# EAGLE design relay_din_board (EAGLE 6.4)
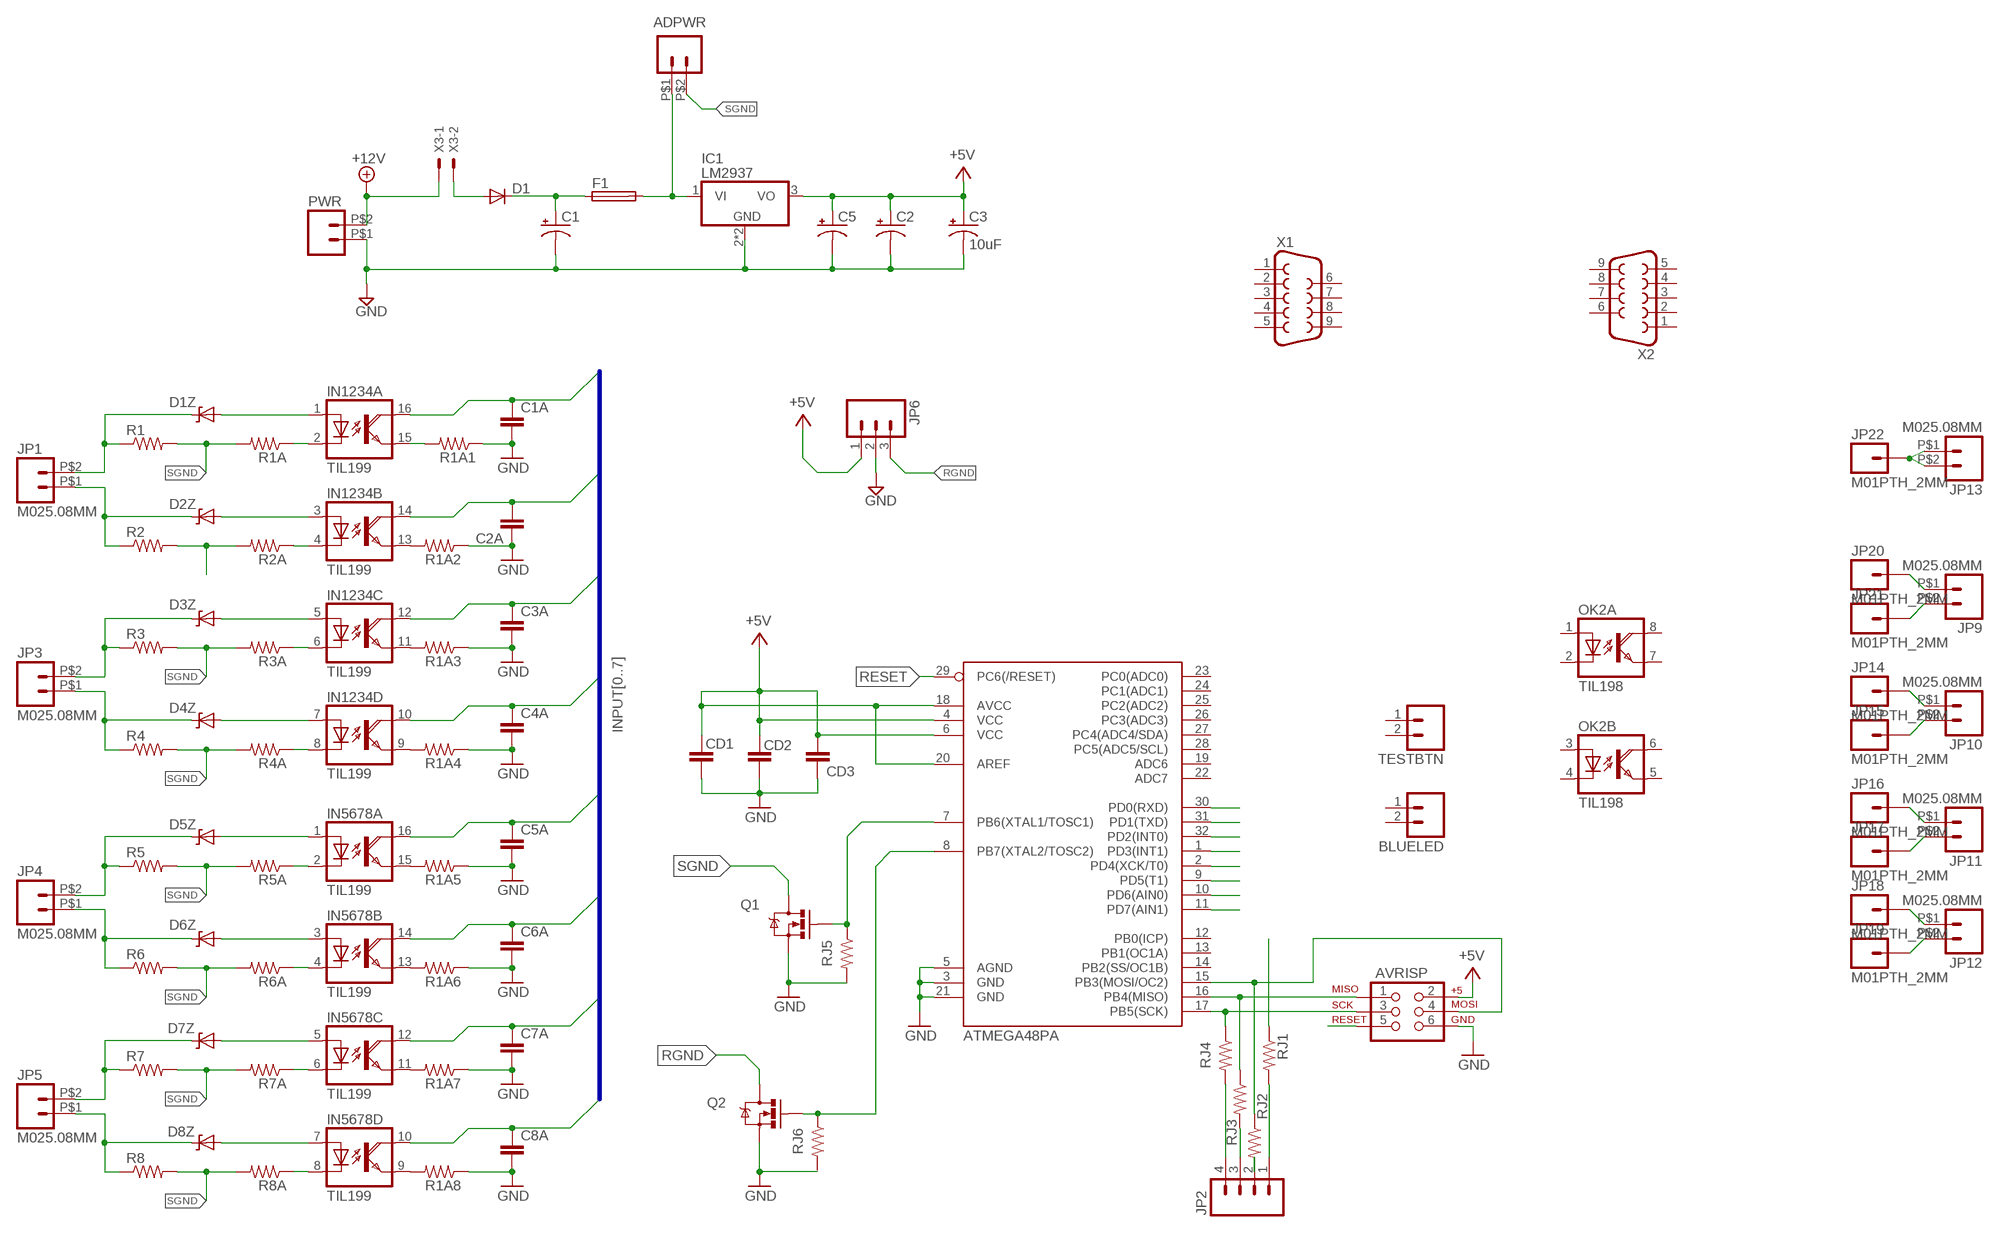
[diagram p0: schematic, sheet 1]

## Parts
ADPWR  M025.08MM  [SCREWTERMINAL-5.08MM-2]
ATMEGA48PA  ATMEGA168  [TQFP32-08]
AVRISP  AVR_SPI_PRG_6PTH  [2X3]
BLUELED  M02PTH  [1X02]
C1  CPOL-USE5-10.5  [E5-10,5]
C1A  CAP0805  [0805]
C2  CPOL-US153CLV-0605  [153CLV-0605]
C2A  CAP0805  [0805]
C3  10uF  10UF-TANT  [EIA3216]
C3A  CAP0805  [0805]
C4A  CAP0805  [0805]
C5  CPOL-US153CLV-0605  [153CLV-0605]
C5A  CAP0805  [0805]
C6A  CAP0805  [0805]
C7A  CAP0805  [0805]
C8A  CAP0805  [0805]
CD1  CAP0805  [0805]
CD2  CAP0805  [0805]
CD3  CAP0805  [0805]
D1  DIODE-C1702-05  [C1702-05]
D1Z  DIODE-ZENER-BZT52  [SOD-323]
D2Z  DIODE-ZENER-BZT52  [SOD-323]
D3Z  DIODE-ZENER-BZT52  [SOD-323]
D4Z  DIODE-ZENER-BZT52  [SOD-323]
D5Z  DIODE-ZENER-BZT52  [SOD-323]
D6Z  DIODE-ZENER-BZT52  [SOD-323]
D7Z  DIODE-ZENER-BZT52  [SOD-323]
D8Z  DIODE-ZENER-BZT52  [SOD-323]
F1  GSH15  [GSH15]
IC1  LM2937  [TO263-3]
IN1234  TIL199  [DIL16]
IN5678  TIL199  [DIL16]
JP1  M025.08MM  [SCREWTERMINAL-5.08MM-2]
JP2  M04PTH  [1X04]
JP3  M025.08MM  [SCREWTERMINAL-5.08MM-2]
JP4  M025.08MM  [SCREWTERMINAL-5.08MM-2]
JP5  M025.08MM  [SCREWTERMINAL-5.08MM-2]
JP6  M03PTH  [1X03]
JP9  M025.08MM  [SCREWTERMINAL-5.08MM-2]
JP10  M025.08MM  [SCREWTERMINAL-5.08MM-2]
JP11  M025.08MM  [SCREWTERMINAL-5.08MM-2]
JP12  M025.08MM  [SCREWTERMINAL-5.08MM-2]
JP13  M025.08MM  [SCREWTERMINAL-5.08MM-2]
JP14  M01PTH_2MM  [1X01_2MM]
JP15  M01PTH_2MM  [1X01_2MM]
JP16  M01PTH_2MM  [1X01_2MM]
JP17  M01PTH_2MM  [1X01_2MM]
JP18  M01PTH_2MM  [1X01_2MM]
JP19  M01PTH_2MM  [1X01_2MM]
JP20  M01PTH_2MM  [1X01_2MM]
JP21  M01PTH_2MM  [1X01_2MM]
JP22  M01PTH_2MM  [1X01_2MM]
OK2  TIL198  [DIL08]
PWR  M025.08MM  [SCREWTERMINAL-5.08MM-2]
Q1  MOSFET-NCHANNELBSS123LT1G  [SOT23]
Q2  MOSFET-NCHANNELBSS123LT1G  [SOT23]
R1  RESISTOR2512  [R2512]
R1A  RESISTOR0805-RES  [0805]
R1A1  RESISTOR0805-RES  [0805]
R1A2  RESISTOR0805-RES  [0805]
R1A3  RESISTOR0805-RES  [0805]
R1A4  RESISTOR0805-RES  [0805]
R1A5  RESISTOR0805-RES  [0805]
R1A6  RESISTOR0805-RES  [0805]
R1A7  RESISTOR0805-RES  [0805]
R1A8  RESISTOR0805-RES  [0805]
R2  RESISTOR2512  [R2512]
R2A  RESISTOR0805-RES  [0805]
R3  RESISTOR2512  [R2512]
R3A  RESISTOR0805-RES  [0805]
R4  RESISTOR2512  [R2512]
R4A  RESISTOR0805-RES  [0805]
R5  RESISTOR2512  [R2512]
R5A  RESISTOR0805-RES  [0805]
R6  RESISTOR2512  [R2512]
R6A  RESISTOR0805-RES  [0805]
R7  RESISTOR2512  [R2512]
R7A  RESISTOR0805-RES  [0805]
R8  RESISTOR2512  [R2512]
R8A  RESISTOR0805-RES  [0805]
RJ1  RESISTOR0805-RES  [0805]
RJ2  RESISTOR0805-RES  [0805]
RJ3  RESISTOR0805-RES  [0805]
RJ4  RESISTOR0805-RES  [0805]
RJ5  RESISTOR0805-RES  [0805]
RJ6  RESISTOR0805-RES  [0805]
TESTBTN  M02PTH  [1X02]
X1  DB9FEMALE  [DB9]
X2  DB9MALE  [DB9_MALE]
X3  22-23-2021  [22-23-2021]

## Nets
+5V: ATMEGA48PA.4(VCC) ATMEGA48PA.6(VCC) ATMEGA48PA.18(AVCC) ATMEGA48PA.20(AREF) AVRISP.2 C2.+ C3.A(+) C5.+ CD1.1 CD2.1 CD3.1 IC1.3(VO) JP6.1
+12V: PWR.P$2 X3.1
GND: ATMEGA48PA.3(GND) ATMEGA48PA.5(AGND) ATMEGA48PA.21(GND) AVRISP.6 C1.- C1A.2 C2.- C2A.1 C3.C(-) C3A.2 C4A.2 C5.- C5A.2 C6A.2 C7A.2 C8A.2 CD1.2 CD2.2 CD3.2 IC1.2(GND) IC1.TAB(GND) JP6.2 PWR.P$1 Q1.2(S) Q2.2(S) R1A1.1 R1A2.1 R1A3.1 R1A4.1 R1A5.1 R1A6.1 R1A7.1 R1A8.1 RJ5.2
INPUT0: ATMEGA48PA.30(PD0(RXD)) C1A.1 IN1234.16(A:COL)
INPUT1: ATMEGA48PA.31(PD1(TXD)) C2A.2 IN1234.14(B:COL)
INPUT2: ATMEGA48PA.32(PD2(INT0)) C3A.1 IN1234.12(C:COL)
INPUT3: ATMEGA48PA.1(PD3(INT1)) C4A.1 IN1234.10(D:COL)
INPUT4: ATMEGA48PA.2(PD4(XCK/T0)) C5A.1 IN5678.16(A:COL)
INPUT5: ATMEGA48PA.9(PD5(T1)) C6A.1 IN5678.14(B:COL)
INPUT6: ATMEGA48PA.10(PD6(AIN0)) C7A.1 IN5678.12(C:COL)
INPUT7: ATMEGA48PA.11(PD7(AIN1)) C8A.1 IN5678.10(D:COL)
N$1: IN1234.15(A:EMI) R1A1.2
N$2: IN1234.13(B:EMI) R1A2.2
N$3: ATMEGA48PA.17(PB5(SCK)) AVRISP.3 RJ4.1
N$4: ATMEGA48PA.16(PB4(MISO)) AVRISP.1 RJ3.1
N$5: IN1234.11(C:EMI) R1A3.2
N$6: IN1234.9(D:EMI) R1A4.2
N$7: IN5678.15(A:EMI) R1A5.2
N$8: IN5678.13(B:EMI) R1A6.2
N$9: IN5678.11(C:EMI) R1A7.2
N$10: IN5678.9(D:EMI) R1A8.2
N$11: JP2.4 RJ4.2
N$12: JP2.3 RJ3.2
N$13: D1Z.1(C) JP1.P$2 R1.1
N$14: D2Z.1(C) JP1.P$1 R2.1
N$15: IN1234.2(A:C) R1A.1
N$16: D1Z.2(A) IN1234.1(A:A)
N$17: D2Z.2(A) IN1234.3(B:A)
N$18: IN1234.4(B:C) R2A.1
N$19: D4Z.1(C) JP3.P$1 R4.1
N$20: D3Z.1(C) JP3.P$2 R3.1
N$21: D5Z.1(C) JP4.P$2 R5.1
N$22: D5Z.2(A) IN5678.1(A:A)
N$23: IN1234.6(C:C) R3A.1
N$24: IN5678.6(C:C) R7A.1
N$25: D4Z.2(A) IN1234.7(D:A)
N$26: IN1234.8(D:C) R4A.1
N$27: JP2.2 RJ2.2
N$28: IN5678.2(A:C) R5A.1
N$29: ADPWR.P$1 F1.2 IC1.1(VI)
N$30: D6Z.2(A) IN5678.3(B:A)
N$31: IN5678.4(B:C) R6A.1
N$32: D6Z.1(C) JP4.P$1 R6.1
N$33: D7Z.1(C) JP5.P$2 R7.1
N$34: D8Z.1(C) JP5.P$1 R8.1
N$35: D3Z.2(A) IN1234.5(C:A)
N$36: D8Z.2(A) IN5678.7(D:A)
N$37: IN5678.8(D:C) R8A.1
N$38: D7Z.2(A) IN5678.5(C:A)
N$39: JP2.1 RJ1.2
N$40: ATMEGA48PA.15(PB3(MOSI/OC2)) AVRISP.4 RJ2.1
N$41: RJ1.1
N$42: C1.+ D1.C F1.1
N$43: D1.A X3.2
N$44: JP10.P$1 JP14.1
N$45: ATMEGA48PA.7(PB6(XTAL1/TOSC1)) Q1.1(G) RJ5.1
N$46: JP10.P$2 JP15.1
N$47: JP11.P$1 JP16.1
N$48: JP12.P$1 JP18.1
N$49: JP12.P$2 JP19.1
N$50: JP11.P$2 JP17.1
N$51: JP9.P$1 JP20.1
N$52: JP9.P$2 JP21.1
N$53: JP13.P$1 JP13.P$2 JP22.1
N$54: ATMEGA48PA.8(PB7(XTAL2/TOSC2)) Q2.1(G) RJ6.1
RESET: ATMEGA48PA.29(PC6(/RESET)) AVRISP.5
RGND: JP6.3 Q2.3(D)
SGND: ADPWR.P$2 Q1.3(D) R1.2 R1A.2 R2.2 R2A.2 R3.2 R3A.2 R4.2 R4A.2 R5.2 R5A.2 R6.2 R6A.2 R7.2 R7A.2 R8.2 R8A.2
Unconnected: ATMEGA48PA.12(PB0(ICP)) ATMEGA48PA.13(PB1(OC1A)) ATMEGA48PA.14(PB2(SS/OC1B)) ATMEGA48PA.19(ADC6) ATMEGA48PA.22(ADC7) ATMEGA48PA.23(PC0(ADC0)) ATMEGA48PA.24(PC1(ADC1)) ATMEGA48PA.25(PC2(ADC2)) ATMEGA48PA.26(PC3(ADC3)) ATMEGA48PA.27(PC4(ADC4/SDA)) ATMEGA48PA.28(PC5(ADC5/SCL)) BLUELED.1 BLUELED.2 OK2.1(A:A) OK2.2(A:C) OK2.3(B:A) OK2.4(B:C) OK2.5(B:EMI) OK2.6(B:COL) OK2.7(A:EMI) OK2.8(A:COL) RJ6.2 TESTBTN.1 TESTBTN.2 X1.1 X1.2 X1.3 X1.4 X1.5 X1.6 X1.7 X1.8 X1.9 X2.1 X2.2 X2.3 X2.4 X2.5 X2.6 X2.7 X2.8 X2.9

## Buses
INPUT[0..7]

## Library data of the parts
ADPWR JP1 JP3-JP5 JP9-JP13 PWR = connectors:M02: Standard 2-pin 0.1" header. Use with - straight break away headers ( PRT-00116) - right angle break away headers (PRT-00553) - swiss pins (PRT-00743) - machine pins (PRT-00117) - female headers (PRT-00115) Molex polarized connector foot print use with: PRT-08233 with associated crimp pins and housings. 2.54_SCREWTERM for use with PRT-10571. 3.5mm Screw Terminal footprints for PRT-08084 5mm Screw Terminal footprints for use with PRT-08433
ATMEGA48PA = SparkFun-DigitalIC:ATMEGA168: Atmel 32-pin 8-bit micro, 16k flash.
AVRISP = SparkFun-Connectors:AVR_SPI_PRG_6: AVR ISP 6 Pin This is the reduced ISP connector for AVR programming. Common on Arduino. This footprint will take up less PCB space and can be used with a 10-pin to 6-pin adapter such as SKU: BOB-08508
BLUELED TESTBTN = SparkFun-Connectors:M02: Standard 2-pin 0.1" header. Use with - straight break away headers ( PRT-00116) - right angle break away headers (PRT-00553) - swiss pins (PRT-00743) - machine pins (PRT-00117) - female headers (PRT-00115) Molex polarized connector foot print use with: PRT-08233 with associated crimp pins and housings. 2.54_SCREWTERM for use with PRT-10571. 3.5mm Screw Terminal footprints for PRT-08084 5mm Screw Terminal footprints for use with PRT-08433
C1 C2 C5 = rcl:CPOL-US: POLARIZED CAPACITOR, American symbol
C1A C2A C3A C4A C5A C6A C7A C8A CD1-CD3 = SparkFun-Passives:CAP: Capacitor Standard 0603 ceramic capacitor, and 0.1" leaded capacitor.
C3 = SparkFun-Capacitors:10UF-TANT: 10uF Tantalum SMT CAP-00811- 16V 10% (EIA-3216); PROD_ID: CAP-00811
D1 = diode:DIODE-: DIODE
D1Z D2Z D3Z D4Z D5Z D6Z D7Z D8Z = SparkFun-DiscreteSemi:DIODE-ZENER: Zener Diode Production Part - 8199 3.4V Zener Voltage
F1 = fuse:GSH15: FUSE HOLDER grid 15mm, 19649 Wickmann; MPN: 64900001039; OC_FARNELL: 1271673; OC_NEWARK: 02P0318
IC1 = linear:LM2937: LM2937-2.5, LM2937-3.3 400mA and 500mA Voltage Regulators Source: http://cache.national.com/ds/LM/LM2937-2.5.pdf
IN1234 IN5678 = optocoupler:TIL199: TEXAS INSTRUMENTS OPTO COUPLER; MPN: TIL 199; OC_FARNELL: 1683370; OC_NEWARK: 05R6483
JP2 = SparkFun-Connectors:M04: Header 4 Standard 4-pin 0.1" header. Use with straight break away headers (SKU : PRT-00116), right angle break away headers (PRT-00553), swiss pins (PRT-00743), machine pins (PRT-00117), and female headers (PRT-00115). Molex polarized connector foot print use with SKU : PRT-08231 with associated crimp pins and housings. 1MM SMD Version SKU: PRT-10208
JP6 = SparkFun-Connectors:M03: Header 3 Standard 3-pin 0.1" header. Use with straight break away headers (SKU : PRT-00116), right angle break away headers (PRT-00553), swiss pins (PRT-00743), machine pins (PRT-00117), and female headers (PRT-00115). Molex polarized connector foot print use with SKU : PRT-08232 with associated crimp pins and housings.
JP14-JP22 = SparkFun-Connectors:M01: Header 1 Standard 1-pin 0.1" header. Use with straight break away headers (SKU : PRT-00116), right angle break away headers (PRT-00553), swiss pins (PRT-00743), machine pins (PRT-00117), and female headers (PRT-00115).
OK2 = optocoupler:TIL198: TEXAS INSTRUMENTS OPTO COUPLER; OC_FARNELL: unknown; OC_NEWARK: unknown
Q1 Q2 = SparkFun-DiscreteSemi:MOSFET-NCHANNEL: Common NMOSFET Parts MFG P/N Store ID Prod ID FDD8780 TRANS-09984 SI7820DN TRANS-11055 FDS6630A IC-08089 2N7002PW TRANS-11151 FQP30N06L COM-10213 TRANS-10060 BSS123LT1G TRANS-08345 BSS138 TRANS-00830 BS170 2N7000; PROD_ID: TRANS-08345
R1-R8 = SparkFun-Passives:RESISTOR: Resistor Basic schematic elements and footprints for 0603, 1206, and PTH resistors.
R1A R1A1-R1A8 R2A R3A R4A R5A R6A R7A R8A RJ1-RJ6 = SparkFun-Resistors:RESISTOR: Resistor Basic schematic elements and footprints for 0603, 1206, and PTH resistors.
X1 X2 = SparkFun-Connectors:DB9: DB9 Connector Standard DB9 (D-Sub 9) serial connector. Can be used for CAN bus as well as RS485 and RS232. Footprint production proven. Spark Fun Electronics SKU : PRT-00429
X3 = con-molex:22-23-2021: .100" (2.54mm) Center Header - 2 Pin; MF: MOLEX; MPN: 22-23-2021; OC_FARNELL: 1462926; OC_NEWARK: 25C3832

## Board
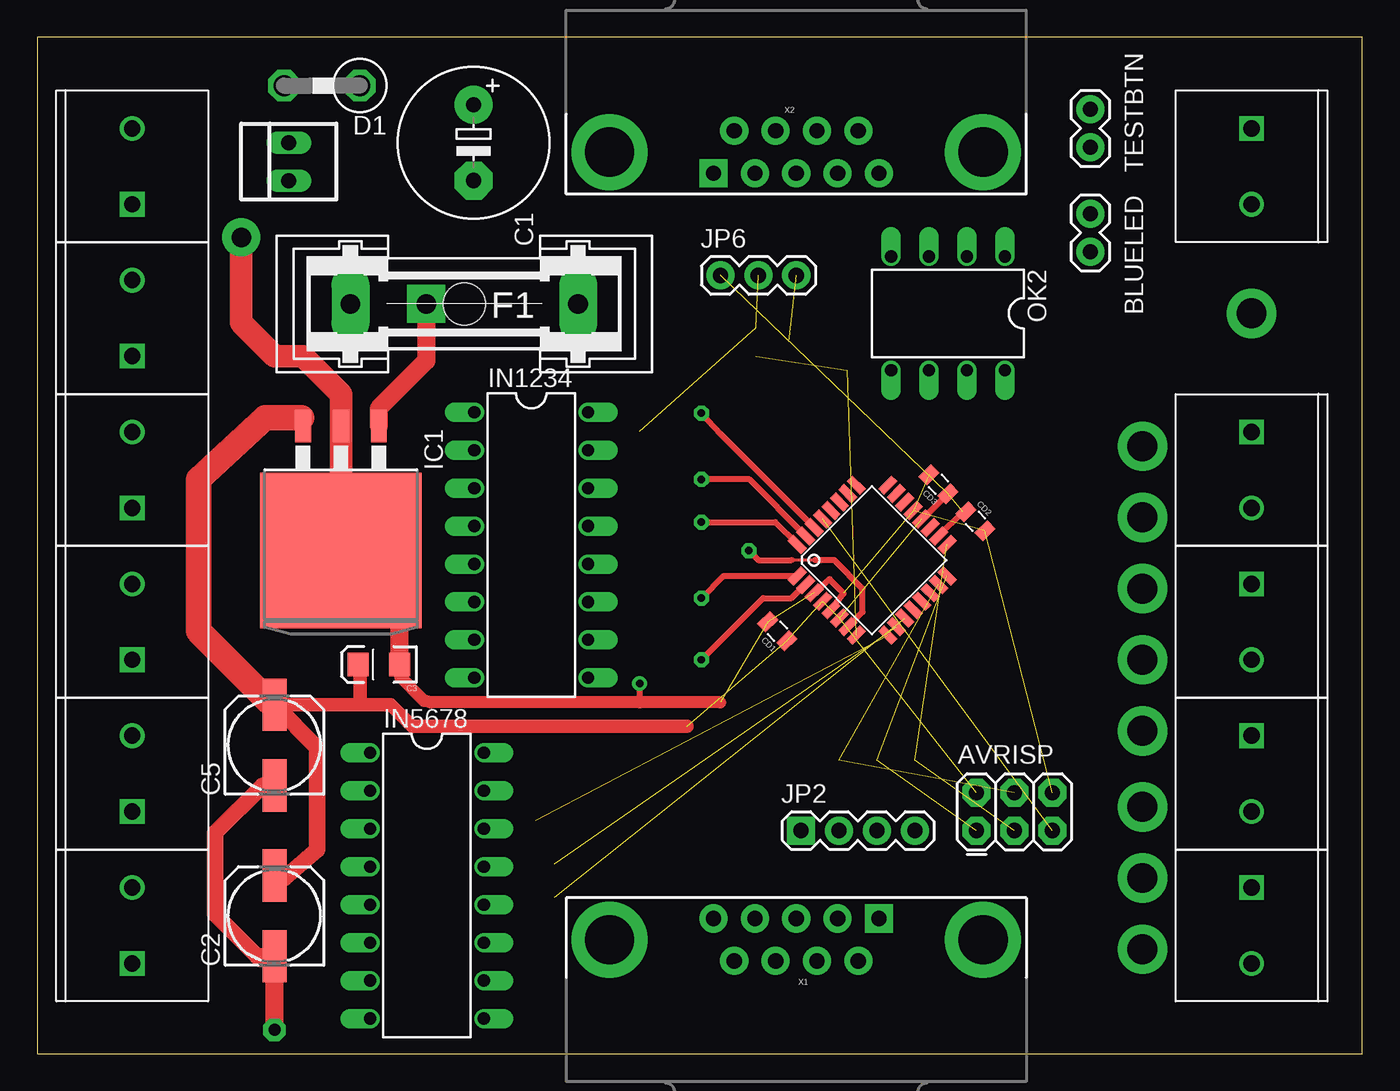
[diagram p1: board, top side]
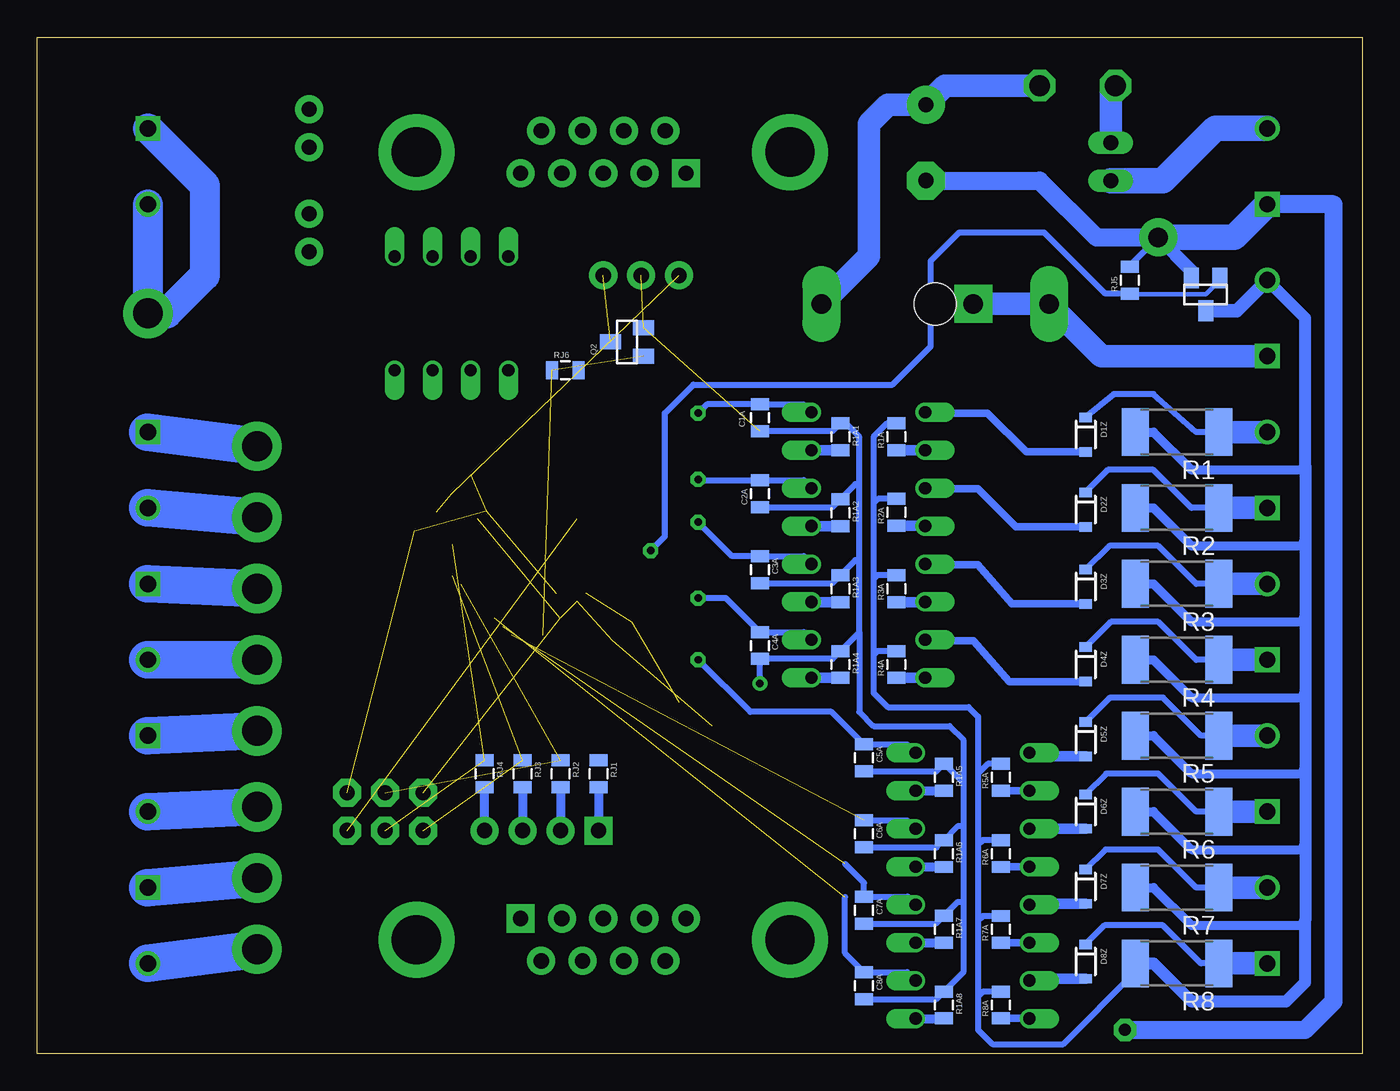
[diagram p2: board, bottom side, seen from below]

Size 88.68 x 68 mm. Coordinates in mm from the lower left corner, seen from the top.
Outline: 0,0 88.68,0 88.68,68 0,68 0,0
Copper layers (1*16): Top 0.035mm / dielectric 1.5mm / Bottom 0.035mm
Design rules "default": minimum track width 10mil, minimum drill 24mil, track to track 8mil, track to pad 8mil, pad to pad 8mil, via to via 8mil, smd to smd 8mil, copper to edge 40mil, drill to drill 8mil, minimum pad ring 10mil, minimum via ring 8mil, stop-mask expansion 4mil, vias tented up to drill 0mil, thermal gap 10mil

### Footprints (pad centres in the part's own frame; a part is rotated, then mirrored left to right if it is on the bottom)
SCREWTERMINAL-5.08MM-2 = drill 1.1 square: P$1 -2.54,0 | drill 1.1: P$2 2.54,0
TQFP32-08 = smd 1.27 x 0.559: 1 -4.293,2.8; 2 -4.293,2; 3 -4.293,1.2; 4 -4.293,0.4; 5 -4.293,-0.4; 6 -4.293,-1.2; 7 -4.293,-2; 8 -4.293,-2.8; 17 4.293,-2.8; 18 4.293,-2; 19 4.293,-1.2; 20 4.293,-0.4; 21 4.293,0.4; 22 4.293,1.2; 23 4.293,2; 24 4.293,2.8 | smd 0.559 x 1.27: 9 -2.8,-4.293; 10 -2,-4.293; 11 -1.2,-4.293; 12 -0.4,-4.293; 13 0.4,-4.293; 14 1.2,-4.293; 15 2,-4.293; 16 2.8,-4.293; 25 2.8,4.293; 26 2,4.293; 27 1.2,4.293; 28 0.4,4.293; 29 -0.4,4.293; 30 -1.2,4.293; 31 -2,4.293; 32 -2.8,4.293
2X3 = drill 1.016 pad 1.88 octagon: 1 0,0; 2 0,2.54; 3 2.54,0; 4 2.54,2.54; 5 5.08,0; 6 5.08,2.54
1X02 = drill 1.016 pad 1.88: 1 0,0; 2 2.54,0
E5-10,5 = drill 1.016 pad 2.54: + -2.54,0 | drill 1.016 pad 2.54 octagon: - 2.54,0
0805 = smd 0.8 x 1.2: 1 -0.9,0; 2 0.9,0
153CLV-0605 = smd 3.5 x 1.6: + 2.7,0; - -2.7,0
EIA3216 = smd 1.4 x 1.6: A 1.4,0; C -1.4,0
C1702-05 = drill 1.397 octagon: A 2.54,0; C -2.54,0
SOD-323 = smd 0.63 x 0.83: 1 -1.15,0; 2 1.15,0
GSH15 = drill 1.321 pad 2.54 long: 1 -7.62,0; 2 7.62,0 | hole 2.794: 0,0
TO263-3 = smd 1.067 x 2.159: 1 -2.54,-5.791; 2 0,-5.791; 3 2.54,-5.791 | smd 10.8 x 10.41: TAB 0,2.54
DIL16 = drill 0.813 offset: 1 -8.89,-3.81; 2 -6.35,-3.81; 3 -3.81,-3.81; 4 -1.27,-3.81; 5 1.27,-3.81; 6 3.81,-3.81; 7 6.35,-3.81; 8 8.89,-3.81; 9 8.89,3.81; 10 6.35,3.81; 11 3.81,3.81; 12 1.27,3.81; 13 -1.27,3.81; 14 -3.81,3.81; 15 -6.35,3.81; 16 -8.89,3.81
1X04 = drill 1.016 pad 1.88 square: 1 0,0 | drill 1.016 pad 1.88: 2 2.54,0; 3 5.08,0; 4 7.62,0
1X03 = drill 1.016 pad 1.88: 1 0,0; 2 2.54,0; 3 5.08,0
1X01_2MM = drill 2 pad 3.302: 1 0,0
DIL08 = drill 0.813 offset: 1 -3.81,-3.81; 2 -1.27,-3.81; 3 1.27,-3.81; 4 3.81,-3.81; 5 3.81,3.81; 6 1.27,3.81; 7 -1.27,3.81; 8 -3.81,3.81
SOT23 = smd 1 x 1.4: 1 -0.95,-1.1; 2 0.95,-1.1; 3 0,1.1
R2512 = smd 1.8 x 3.2: 1 -2.8,0; 2 2.8,0
DB9 = drill 1.016 pad 1.88 square: 1 -5.54,-1.42 | drill 1.016 pad 1.88: 2 -2.77,-1.42; 3 0,-1.42; 4 2.77,-1.42; 5 5.54,-1.42; 6 -4.15,1.42; 7 -1.38,1.42; 8 1.38,1.42; 9 4.15,1.42 | drill 3.302 pad 5.08: G1 -12.5,0; G2 12.5,0
DB9_MALE = drill 1.016 pad 1.88: 1 5.54,-1.42; 2 2.77,-1.42; 3 0,-1.42; 4 -2.77,-1.42; 6 4.15,1.42; 7 1.38,1.42; 8 -1.38,1.42; 9 -4.15,1.42 | drill 1.016 pad 1.88 square: 5 -5.54,-1.42 | drill 3.302 pad 5.08: G1 -12.5,0; G2 12.5,0
22-23-2021 = drill 1 long: 1 -1.27,0; 2 1.27,0

### Placement (x,y rotation side)
ADPWR  6.35,49.21 90 top
ATMEGA48PA  55.88,33.02 45 top
AVRISP  62.87,14.92 0 top
BLUELED  70.48,53.66 90 top
C1  29.21,60.96 270 top
C1A  40.32,42.55 270 bottom
C2  15.88,9.21 90 top
C2A  40.32,37.47 90 bottom
C3  22.86,26.04 180 top
C3A  40.32,32.38 270 bottom
C4A  40.32,27.3 270 bottom
C5  15.88,20.64 90 top
C5A  33.34,19.79 270 bottom
C6A  33.34,14.71 270 bottom
C7A  33.34,9.6 270 bottom
C8A  33.34,4.55 270 bottom
CD1  49.53,28.26 135 top
CD2  62.8,35.62 315 top
CD3  60.33,38.1 135 top
D1  19.05,64.77 180 top
D1Z  18.51,41.42 270 bottom
D2Z  18.51,36.4 270 bottom
D3Z  18.51,31.25 270 bottom
D4Z  18.51,26.05 270 bottom
D5Z  18.51,21.03 270 bottom
D6Z  18.51,16.2 270 bottom
D7Z  18.51,11.18 270 bottom
D8Z  18.51,6.16 270 bottom
F1  28.57,50.16 180 top
IC1  20.32,36.2 180 top
IN1234  33.06,34.03 270 top
IN5678  26.08,11.24 270 top
JP1  6.35,39.05 90 top
JP2  51.12,14.92 0 top
JP3  6.35,28.89 90 top
JP4  6.35,18.73 90 top
JP5  6.35,8.57 90 top
JP6  45.72,52.07 0 top
JP9  81.28,39.05 270 top
JP10  81.28,28.89 270 top
JP11  81.28,18.73 270 top
JP12  81.28,8.57 270 top
JP13  81.28,59.37 270 top
JP14  73.98,31.11 0 top
JP15  73.98,26.35 0 top
JP16  73.98,21.59 0 top
JP17  73.98,16.51 0 top
JP18  73.98,11.75 0 top
JP19  73.98,6.99 0 top
JP20  73.98,40.64 0 top
JP21  73.98,35.88 0 top
JP22  81.28,49.53 0 top
OK2  60.96,49.53 180 top
PWR  6.35,59.37 90 top
Q1  10.48,50.8 180 bottom
Q2  49.21,47.62 90 bottom
R1  12.38,41.59 180 bottom
R1A  31.18,41.27 90 bottom
R1A1  34.92,41.27 270 bottom
R1A2  34.92,36.2 270 bottom
R1A3  34.92,31.11 270 bottom
R1A4  34.92,26.04 270 bottom
R1A5  28,18.49 270 bottom
R1A6  28,13.39 270 bottom
R1A7  28,8.33 270 bottom
R1A8  28,3.25 270 bottom
R2  12.38,36.51 180 bottom
R2A  31.18,36.22 90 bottom
R3  12.38,31.43 180 bottom
R3A  31.18,31.11 90 bottom
R4  12.38,26.35 180 bottom
R4A  31.18,26.04 90 bottom
R5  12.38,21.27 180 bottom
R5A  24.19,18.49 90 bottom
R6  12.38,16.19 180 bottom
R6A  24.19,13.39 90 bottom
R7  12.38,11.11 180 bottom
R7A  24.19,8.31 90 bottom
R8  12.38,6.03 180 bottom
R8A  24.19,3.25 90 bottom
RJ1  51.12,18.73 270 bottom
RJ2  53.66,18.73 270 bottom
RJ3  56.2,18.73 270 bottom
RJ4  58.74,18.73 270 bottom
RJ5  15.56,51.75 90 bottom
RJ6  53.34,45.72 0 bottom
TESTBTN  70.48,60.64 90 top
X1  50.8,7.62 180 top
X2  50.8,60.33 0 top
X3  16.83,59.69 90 top

### Tracks (layer width: path | path; a pad name or v marks a point on that pad's centre or on a via)
+5V  (7 unrouted)
  Top 0.406: CD3.1 59.27,35.77 ATMEGA48PA.20 | CD2.1 61.95,36.26 ATMEGA48PA.18
  Top 0.9: C5.+ 21.59,23.34 | 21.59,23.34 23.65,23.34 25.08,21.91 43.49,21.91 | 21.59,25.91 21.59,23.34
  Top 1: C3.A 21.59,25.91
  Top 1.1: C2.+ 16.51,11.75 18.73,13.65 18.73,20.48 C5.+ 15.56,23.5 | 17.7,42.55 IC1.3
  Top 1.7: 15.56,23.5 10.79,28.26 10.79,38.42 15.24,42.55 17.7,42.55
+12V
  Bottom 1.7: X3.1 13.34,58.42 9.84,61.91 PWR.P$2
GND  (via drill 0.5 pad 1, 0.8 pad 1.5, 1.3 pad 2.54)  (8 unrouted)
  Top 0.4: IC1.TAB 20.32,34.29
  Top 0.406: ATMEGA48PA.3 53.02,31.75 53.98,30.8 ATMEGA48PA.5 | 24.26,25.27 C3.C | v40.32,24.77 40.32,23.5
  Top 0.8: 45.72,23.5 40.32,23.5 26.35,23.5 25.88,23.6 24.26,25.27
  Top 1.1: C5.- 15.08,17.94 11.91,14.76 11.91,9.31 14.71,6.51 | 14.71,6.51 C2.- | 14.71,6.51 14.87,6.35 15.24,6.35
  Top 1.2: C3.C 24.26,30.35 | v15.88,1.59 C2.-
  Top 1.5: v13.65,54.61 13.65,48.9 15.88,46.67 17.78,46.67 20.32,44.13 IC1.2 20.32,34.29 24.26,30.35
  Bottom 0.4: R1A4.1 35.45,26.41 C4A.2 | C3A.2 35.45,31.48 R1A3.1 | R1A1.1 35.45,41.65 C1A.2 | C2A.1 35.45,36.56 R1A2.1 | 26.67,10.16 26.67,5.49 R1A8.1 28.51,3.65 C8A.2 | 26.67,10.16 26.67,15.24 | 26.67,15.24 26.67,18.1 | 26.67,18.1 27.96,19.39 R1A5.1 28.51,18.89 C5A.2 | 26.67,15.24 27.05,15.24 R1A6.1 28.48,13.81 C6A.2 | 26.67,10.16 27.07,10.16 R1A7.1 28.53,8.7 C7A.2 | 26.67,18.1 26.67,20.95 27.62,21.91 32.7,21.91
  Bottom 0.406: R1A4.1 33.66,28.2 | 33.66,28.2 33.66,33.02 | 33.66,33.02 33.66,38.1 | 33.66,38.1 33.66,41.27 34.55,42.17 R1A1.1 | R1A3.1 33.92,33.02 33.66,33.02 | R1A2.1 33.92,38.1 33.66,38.1 | RJ5.2 15.56,52.7 v13.65,54.61 | 33.66,28.2 33.66,22.86 32.7,21.91 | v40.32,24.77 C4A.2
  Bottom 0.9: Q1.2 11.43,52.38 v13.65,54.61
  Bottom 1.2: C1.- 21.59,58.42 17.78,54.61 v13.65,54.61 | v15.88,1.59 3.81,1.59 1.91,3.49 1.91,56.83 PWR.P$1
  Bottom 1.7: v13.65,54.61 8.57,54.61 PWR.P$1
INPUT0  (via drill 0.5 pad 1)
  Top 0.406: v44.45,42.86 45.72,41.48 ATMEGA48PA.30
  Bottom 0.4: C1A.1 37.4,43.45 IN1234.16
  Bottom 0.406: C1A.1 43.87,43.45 v44.45,42.86
INPUT1  (via drill 0.5 pad 1)
  Top 0.406: ATMEGA48PA.31 47.65,38.42 v44.45,38.42
  Bottom 0.4: C2A.2 37.4,38.37 IN1234.14
  Bottom 0.406: v44.45,38.42 44.08,38.37 C2A.2
INPUT2  (via drill 0.5 pad 1)
  Top 0.406: v44.45,35.56 49.38,35.56 ATMEGA48PA.32
  Bottom 0.4: C3A.1 37.4,33.28 IN1234.12
  Bottom 0.406: C3A.1 42.17,33.28 v44.45,35.56
INPUT3  (via drill 0.5 pad 1)
  Top 0.406: v44.45,30.48 45.94,31.96 ATMEGA48PA.1
  Bottom 0.4: C4A.1 37.4,28.2 IN1234.10
  Bottom 0.406: C4A.1 42.6,30.48 v44.45,30.48
INPUT4  (via drill 0.5 pad 1)
  Top 0.406: v44.45,26.35 48.58,30.48 50.48,30.48 51.4,31.4 ATMEGA48PA.2
  Bottom 0.4: C5A.1 30.45,20.69 IN5678.16
  Bottom 0.406: C5A.1 35.51,22.86 40.96,22.86 v44.45,26.35
INPUT5  (1 unrouted)
  Bottom 0.4: C6A.1 30.45,15.61 IN5678.14
INPUT6  (1 unrouted)
  Bottom 0.4: IN5678.12 30.42,10.5 C7A.1 33.34,11.43 34.61,12.7
INPUT7  (1 unrouted)
  Bottom 0.4: IN5678.10 30.45,5.45 C8A.1 34.61,6.72 34.61,10.48
N$1
  Bottom 0.7: IN1234.15 R1A1.2
N$2
  Bottom 0.7: IN1234.13 R1A2.2
N$3  (2 unrouted)
N$4  (2 unrouted)
N$5
  Bottom 0.7: IN1234.11 R1A3.2
N$6
  Bottom 0.7: IN1234.9 R1A4.2
N$7
  Bottom 0.6: IN5678.15 R1A5.2
N$8
  Bottom 0.6: IN5678.13 28.02,12.51 R1A6.2
N$9
  Bottom 0.6: IN5678.11 R1A7.2
N$10
  Bottom 0.6: IN5678.9 R1A8.2
N$11
  Bottom 0.6: JP2.4 RJ4.2
N$12
  Bottom 0.6: RJ3.2 JP2.3
N$13
  Bottom 0.406: R1.1 11.11,41.59 13.97,44.13 16.63,44.13 D1Z.1
  Bottom 1.5: JP1.P$2 R1.1
N$14
  Bottom 0.406: R2.1 11.43,36.51 13.97,39.05 17.01,39.05 D2Z.1
  Bottom 1.5: JP1.P$1 R2.1
N$15
  Bottom 0.7: IN1234.2 R1A.1
N$16
  Bottom 0.5: D1Z.2 22.49,40.27 25.08,42.86 28.88,42.86 IN1234.1
N$17
  Bottom 0.5: D2Z.2 23.18,35.25 25.72,37.78 28.88,37.78 IN1234.3
N$18
  Bottom 0.7: IN1234.4 29.27,35.32 R2A.1
N$19
  Bottom 0.406: R4.1 11.11,26.35 13.65,28.89 16.82,28.89 D4Z.1
  Bottom 1.5: JP3.P$1 R4.1
N$20
  Bottom 0.406: R3.1 11.11,31.43 13.65,33.97 16.94,33.97 D3Z.1
  Bottom 1.5: R3.1 JP3.P$2
N$21
  Bottom 0.406: R5.1 10.79,21.27 13.34,23.81 16.88,23.81 D5Z.1
  Bottom 1.5: JP4.P$2 R5.1
N$22
  Bottom 0.7: D5Z.2 22.02,19.88 IN5678.1
N$23
  Bottom 0.7: IN1234.6 R3A.1
N$24
  Bottom 0.5: R7A.1 22.29,7.41 IN5678.6
N$25
  Bottom 0.5: D4Z.2 23.63,24.9 26.04,27.62 28.56,27.62 IN1234.7
N$26
  Bottom 0.7: IN1234.8 R4A.1
N$27
  Bottom 0.6: RJ2.2 JP2.2
N$28
  Bottom 0.5: IN5678.2 R5A.1
N$29  (via drill 1.3 pad 2.54)
  Top 1.2: v26.04,50.16 26.04,46.35 22.86,43.18 IC1.1
  Bottom 1.5: v26.04,50.16 F1.2 17.46,46.67 ADPWR.P$1
N$30
  Bottom 0.7: D6Z.2 IN5678.3
N$31
  Bottom 0.5: R6A.1 22.29,12.49 IN5678.4
N$32
  Bottom 0.406: R6.1 11.11,16.19 13.65,18.73 17.12,18.73 D6Z.1
  Bottom 1.5: JP4.P$1 R6.1
N$33
  Bottom 0.406: R7.1 11.11,11.11 13.65,13.65 17.19,13.65 D7Z.1
  Bottom 1.5: JP5.P$2 R7.1
N$34
  Bottom 0.406: R8.1 10.79,6.03 13.34,8.57 17.25,8.57 D8Z.1
  Bottom 1.5: JP5.P$1 R8.1
N$35
  Bottom 0.5: D3Z.2 23.43,30.1 25.72,32.7 28.24,32.7 IN1234.5
N$36
  Bottom 0.7: D8Z.2 22.14,5.01 IN5678.7
N$37
  Bottom 0.5: R8A.1 IN5678.8
N$38
  Bottom 0.7: D7Z.2 22.21,10.03 IN5678.5
N$39
  Bottom 0.6: RJ1.2 JP2.1
N$40  (2 unrouted)
N$42
  Bottom 1.5: D1.C 27.94,64.77 C1.+ 31.75,63.5 33.02,62.23 33.02,53.34 F1.1
N$43
  Bottom 1.2: 16.83,64.45 D1.A
  Bottom 1.5: X3.2 16.83,64.45
N$44
  Bottom 2.5: JP14.1 JP10.P$1
N$45  (via drill 0.5 pad 1)
  Top 0.2: 52.07,33.02 50.48,33.02
  Top 0.4: 53.34,33.02 52.07,33.02 | 48.26,33.02 50.48,33.02
  Top 0.406: ATMEGA48PA.7 55.24,29.56 55.24,31.11 53.34,33.02 | 48.26,33.02 v47.62,33.66
  Bottom 0.3: 9.53,51.75 10.48,50.8 15.51,50.8
  Bottom 0.4: Q1.1 9.53,51.75 | 15.51,50.8 RJ5.1
  Bottom 0.406: v47.62,33.66 46.67,34.61 46.67,42.86 44.77,44.77 31.43,44.77 28.89,47.31 28.89,53.02 26.99,54.93 21.27,54.93 17.2,50.85 RJ5.1
N$46
  Bottom 2.5: JP15.1 JP10.P$2
N$47
  Bottom 2.5: JP16.1 JP11.P$1
N$48
  Bottom 2.5: JP18.1 JP12.P$1
N$49
  Bottom 2.5: JP19.1 JP12.P$2
N$50
  Bottom 2.5: JP17.1 JP11.P$2
N$51
  Bottom 2.5: JP20.1 JP9.P$1
N$52
  Bottom 2.5: JP21.1 JP9.P$2
N$53
  Bottom 1.7: 80.01,49.53 JP22.1
  Bottom 2: JP13.P$1 77.47,58.1 77.47,52.07 80.01,49.53 | JP13.P$2 JP22.1
N$54  (2 unrouted)
RESET  (1 unrouted)
RGND  (1 unrouted)
SGND
  Bottom 0.406: R5A.2 25.06,19.39 25.72,18.73 | 25.72,18.73 25.72,13.97 | 25.72,13.97 25.72,8.89 | 25.72,8.89 25.72,3.81 | 25.72,3.81 25.72,1.59 24.77,0.64 20,0.64 15.24,5.4 15.24,5.97 R8.2 | R8A.2 25.38,4.15 25.72,3.81 | R7A.2 25.4,9.21 25.72,8.89 | R6A.2 25.4,14.29 25.72,13.97 | R1A.2 31.8,42.17 32.7,41.27 32.7,36.83 | 32.7,36.83 32.7,31.75 | 32.7,31.75 32.7,26.67 | 32.7,26.67 32.7,24.13 31.75,23.18 26.35,23.18 25.72,22.54 25.72,18.73 | R4A.2 32.44,26.93 32.7,26.67 | R3A.2 32.44,32.02 32.7,31.75 | R2A.2 32.41,37.12 32.7,36.83
  Bottom 0.6: R1.2 13.97,41.59 11.43,39.05 4.13,39.05 3.81,39.37 | R2.2 13.97,36.51 11.43,33.97 4.13,33.97 3.81,34.29 | R3.2 13.97,31.43 11.43,28.89 4.13,28.89 3.81,29.21 | R4.2 13.97,26.35 11.43,23.81 4.13,23.81 3.81,24.13 | R5.2 13.97,21.27 11.43,18.73 4.13,18.73 3.81,19.05 | R6.2 13.97,16.19 11.43,13.65 4.13,13.65 3.81,13.97 | R7.2 13.97,11.11 11.43,8.57 4.13,8.57 3.81,8.89
  Bottom 0.8: R8.2 13.97,6.03 11.43,3.49 5.08,3.49 3.81,4.76 3.81,8.89 3.81,13.97 3.81,19.05 3.81,24.13 3.81,29.21 3.81,34.29 3.81,39.37 3.81,49.21 ADPWR.P$2
  Bottom 0.9: Q1.3 8.4,49.7 ADPWR.P$2
(copper drawn outside any net)
  shapes: Top area x1